# EAGLE design coin_acceptor (EAGLE 8.3.1)
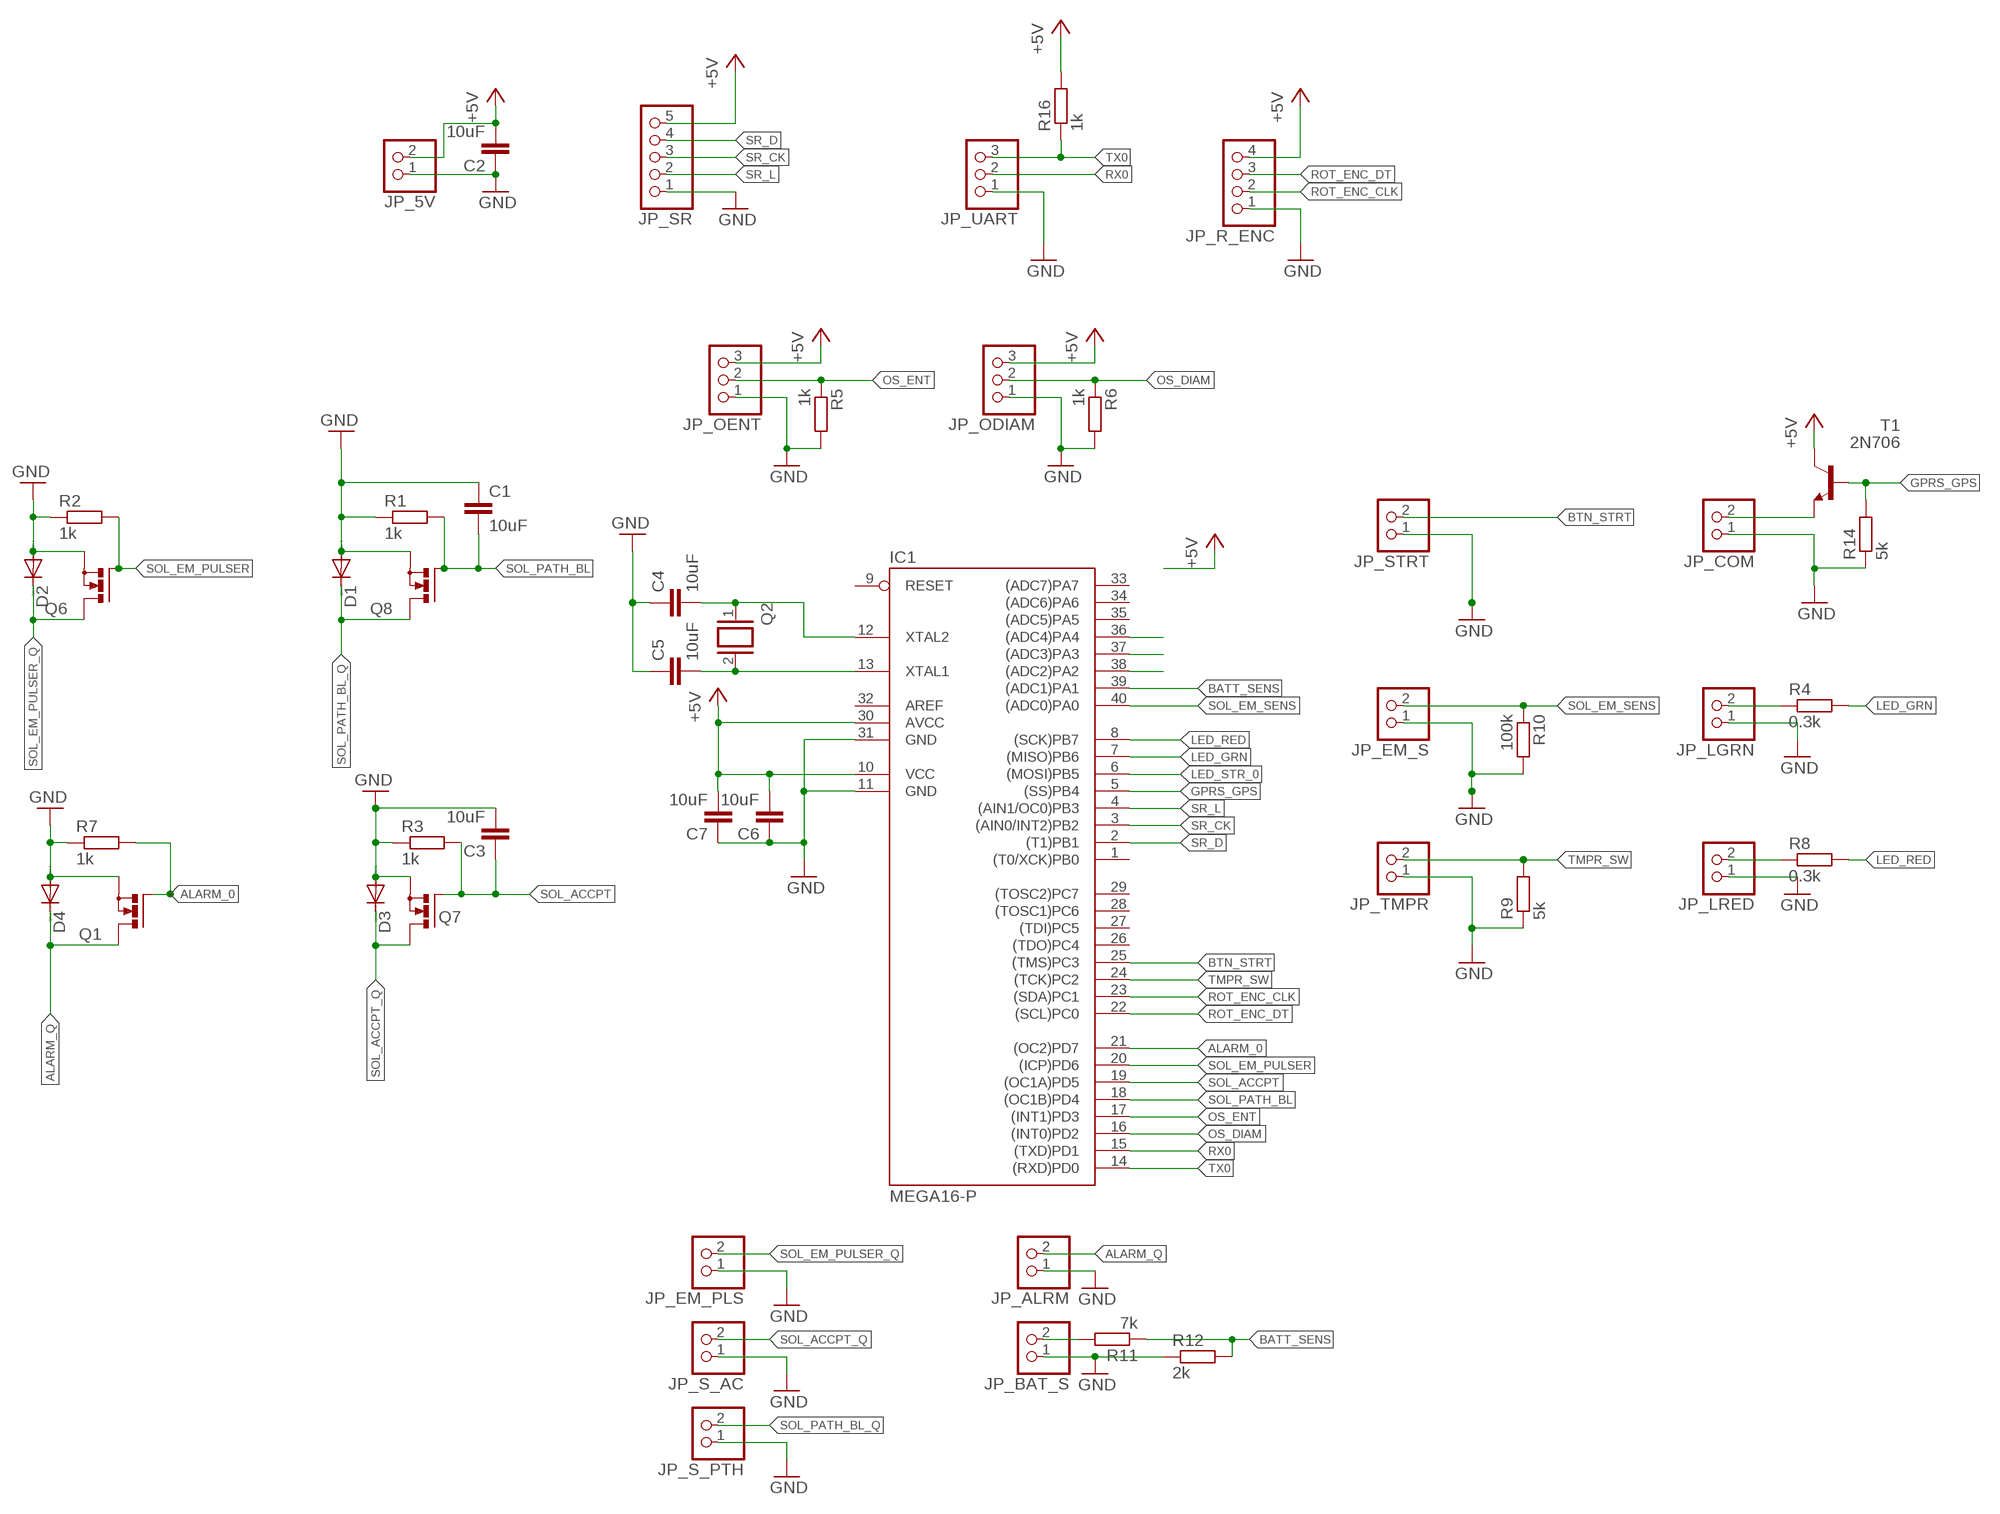
[diagram p0: schematic, sheet 1]

## Parts
C1  10uF  C-EU025-024X044  [C025-024X044]
C2  10uF  C-EU025-024X044  [C025-024X044]
C3  10uF  C-EU025-024X044  [C025-024X044]
C4  10uF  C-EU025-024X044  [C025-024X044]
C5  10uF  C-EU025-024X044  [C025-024X044]
C6  10uF  C-EU025-024X044  [C025-024X044]
C7  10uF  C-EU025-024X044  [C025-024X044]
D1  DIODE-DO35-10  [DO35-10]
D2  DIODE-DO35-10  [DO35-10]
D3  DIODE-DO35-10  [DO35-10]
D4  DIODE-DO35-10  [DO35-10]
IC1  MEGA16-P  [DIL40]
JP_5V  PINHD-1X2  [1X02]
JP_ALRM  PINHD-1X2  [1X02]
JP_BAT_S  PINHD-1X2  [1X02]
JP_COM  PINHD-1X2  [1X02]
JP_EM_PLS  PINHD-1X2  [1X02]
JP_EM_S  PINHD-1X2  [1X02]
JP_LGRN  PINHD-1X2  [1X02]
JP_LRED  PINHD-1X2  [1X02]
JP_ODIAM  PINHD-1X3  [1X03]
JP_OENT  PINHD-1X3  [1X03]
JP_R_ENC  PINHD-1X4  [1X04]
JP_S_AC  PINHD-1X2  [1X02]
JP_S_PTH  PINHD-1X2  [1X02]
JP_SR  PINHD-1X5  [1X05]
JP_STRT  PINHD-1X2  [1X02]
JP_TMPR  PINHD-1X2  [1X02]
JP_UART  PINHD-1X3  [1X03]
Q1  IRF512  [TO220BV]
Q2  XTAL  [Q]
Q6  IRF512  [TO220BV]
Q7  IRF512  [TO220BV]
Q8  IRF512  [TO220BV]
R1  1k  R-EU_0309/10  [0309/10]
R2  1k  R-EU_0309/10  [0309/10]
R3  1k  R-EU_0309/10  [0309/10]
R4  0.3k  R-EU_0309/10  [0309/10]
R5  1k  R-EU_0309/10  [0309/10]
R6  1k  R-EU_0309/10  [0309/10]
R7  1k  R-EU_0309/10  [0309/10]
R8  0.3k  R-EU_0309/10  [0309/10]
R9  5k  R-EU_0309/10  [0309/10]
R10  100k  R-EU_0309/10  [0309/10]
R11  7k  R-EU_0309/10  [0309/10]
R12  2k  R-EU_0309/10  [0309/10]
R14  5k  R-EU_0309/10  [0309/10]
R16  1k  R-EU_0309/10  [0309/10]
T1  2N706  [TO18]

## Nets
+5V [Supply]: C2.2 C6.2 C7.2 IC1.10(VCC) IC1.30(AVCC) JP_5V.2 JP_ODIAM.3 JP_OENT.3 JP_R_ENC.4 JP_SR.5 R16.2 T1.3(C)
ALARM_0: IC1.21((OC2)PD7) Q1.G R7.2
ALARM_Q: D4.C JP_ALRM.2 Q1.D
BATT_SENS: IC1.39((ADC1)PA1) R11.1 R12.2
BTN_STRT: IC1.25((TMS)PC3) JP_STRT.2
GND [Supply]: C1.1 C2.1 C3.2 C4.1 C5.1 C6.1 C7.1 D1.A D2.A D3.A D4.A IC1.11(GND) IC1.31(GND) JP_5V.1 JP_ALRM.1 JP_BAT_S.1 JP_COM.1 JP_EM_PLS.1 JP_EM_S.1 JP_LGRN.1 JP_LRED.1 JP_ODIAM.1 JP_OENT.1 JP_R_ENC.1 JP_S_AC.1 JP_S_PTH.1 JP_SR.1 JP_STRT.1 JP_TMPR.1 JP_UART.1 Q1.S Q6.S Q7.S Q8.S R1.1 R2.1 R3.1 R5.2 R6.2 R7.1 R9.1 R10.2 R12.1 R14.1
GPRS_GPS: IC1.5((SS)PB4) R14.2 T1.2(B)
LED_GRN: IC1.7((MISO)PB6) R4.2
LED_RED: IC1.8((SCK)PB7) R8.2
LED_STR_0: IC1.6((MOSI)PB5)
N$1: JP_BAT_S.2 R11.2
N$2: C4.2 IC1.12(XTAL2) Q2.1
N$4: IC1.38((ADC2)PA2)
N$5: IC1.37((ADC3)PA3)
N$6: IC1.36((ADC4)PA4)
N$7: C5.2 IC1.13(XTAL1) Q2.2
OS_DIAM: IC1.16((INT0)PD2) JP_ODIAM.2 R6.1
OS_ENT: IC1.17((INT1)PD3) JP_OENT.2 R5.1
ROT_ENC_CLK: IC1.23((SDA)PC1) JP_R_ENC.2
ROT_ENC_DT: IC1.22((SCL)PC0) JP_R_ENC.3
RX0: IC1.15((TXD)PD1) JP_UART.2
SOL_ACCPT: C3.1 IC1.19((OC1A)PD5) Q7.G R3.2
SOL_ACCPT_OUT2: JP_LGRN.2 R4.1
SOL_ACCPT_Q: D3.C JP_S_AC.2 Q7.D
SOL_EM_PULSER: IC1.20((ICP)PD6) Q6.G R2.2
SOL_EM_PULSER_OUT2: JP_COM.2 T1.1(E)
SOL_EM_PULSER_Q: D2.C JP_EM_PLS.2 Q6.D
SOL_EM_SENS [Analog]: IC1.40((ADC0)PA0) JP_EM_S.2 R10.1
SOL_PATH_BL: C1.2 IC1.18((OC1B)PD4) Q8.G R1.2
SOL_PATH_BL_OUT2: JP_LRED.2 R8.1
SOL_PATH_BL_Q: D1.C JP_S_PTH.2 Q8.D
SR_CK: IC1.3((AIN0/INT2)PB2) JP_SR.3
SR_D: IC1.2((T1)PB1) JP_SR.4
SR_L: IC1.4((AIN1/OC0)PB3) JP_SR.2
TMPR_SW: IC1.24((TCK)PC2) JP_TMPR.2 R9.2
TX0: IC1.14((RXD)PD0) JP_UART.3 R16.1
Unconnected: IC1.1((T0/XCK)PB0) IC1.9(RESET) IC1.26((TDO)PC4) IC1.27((TDI)PC5) IC1.28((TOSC1)PC6) IC1.29((TOSC2)PC7) IC1.32(AREF) IC1.33((ADC7)PA7) IC1.34((ADC6)PA6) IC1.35((ADC5)PA5)

## Library data of the parts
C1-C7 = rcl:C-EU: CAPACITOR, European symbol
D1-D4 = diode:DIODE-: DIODE
IC1 = atmel:MEGA16-P: MICROCONTROLLER 16 Kbytes FLASH 1 kbytes SRAM 512 bytes EEPROM USART 8-channel 10 bit ADC Source: avr.lbr; MPN: ATMEGA16-16PU; OC_FARNELL: 9171142; OC_NEWARK: 01M6885
JP_5V JP_ALRM JP_BAT_S JP_COM JP_EM_PLS JP_EM_S JP_LGRN JP_LRED JP_S_AC JP_S_PTH JP_STRT JP_TMPR = pinhead:PINHD-1X2: PIN HEADER
JP_ODIAM JP_OENT JP_UART = pinhead:PINHD-1X3: PIN HEADER
JP_R_ENC = pinhead:PINHD-1X4: PIN HEADER
JP_SR = pinhead:PINHD-1X5: PIN HEADER
Q1 Q6-Q8 = transistor-power:IRF512: N-CHANNEL MOS FET
Q2 = special:XTAL: CRYSTAL
R1-R12 R14 R16 = resistor:R-EU_: RESISTOR, European symbol
T1 = transistor:2N706: NPN TRANSISTOR

## Net classes
0 default: width 0.508 mm, drill 0.254 mm, clearance 0.305 mm
1 Supply: width 1.016 mm, drill 0.254 mm, clearance 0.305 mm
2 Analog: width 0.762 mm, drill 0.254 mm, clearance 0.61 mm

## Board
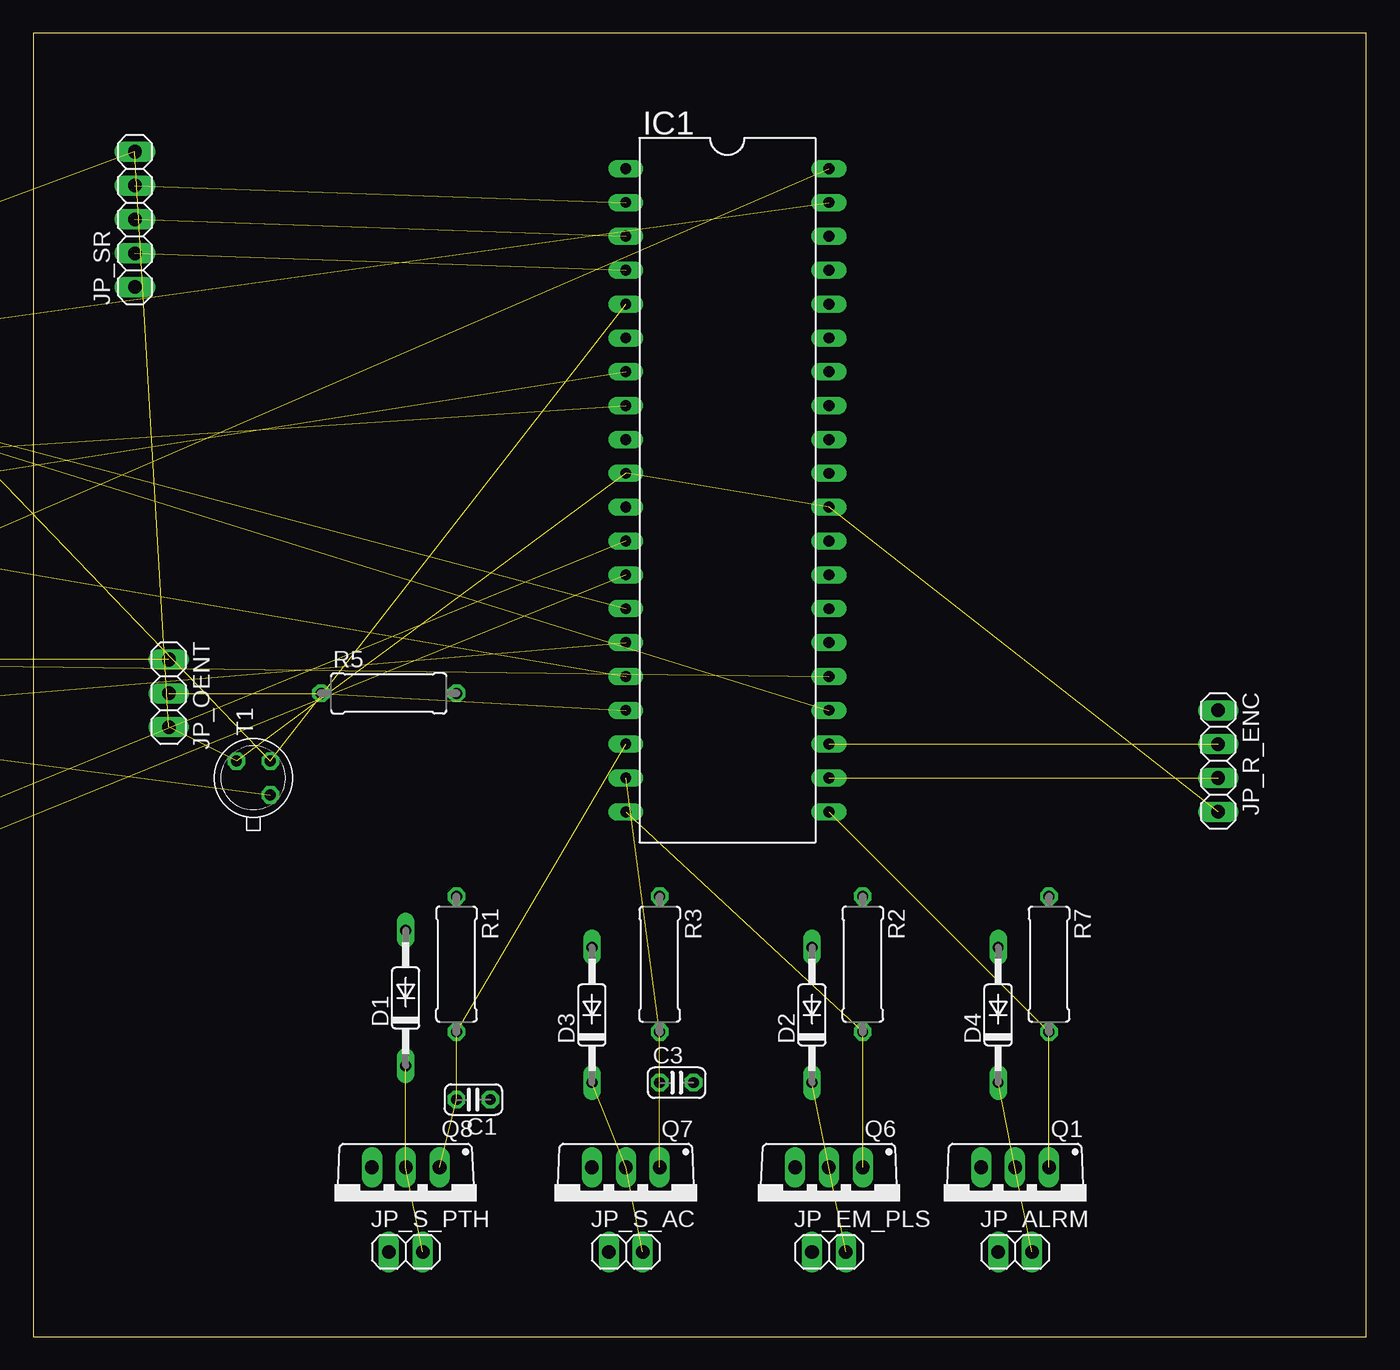
[diagram p1: board, top side]
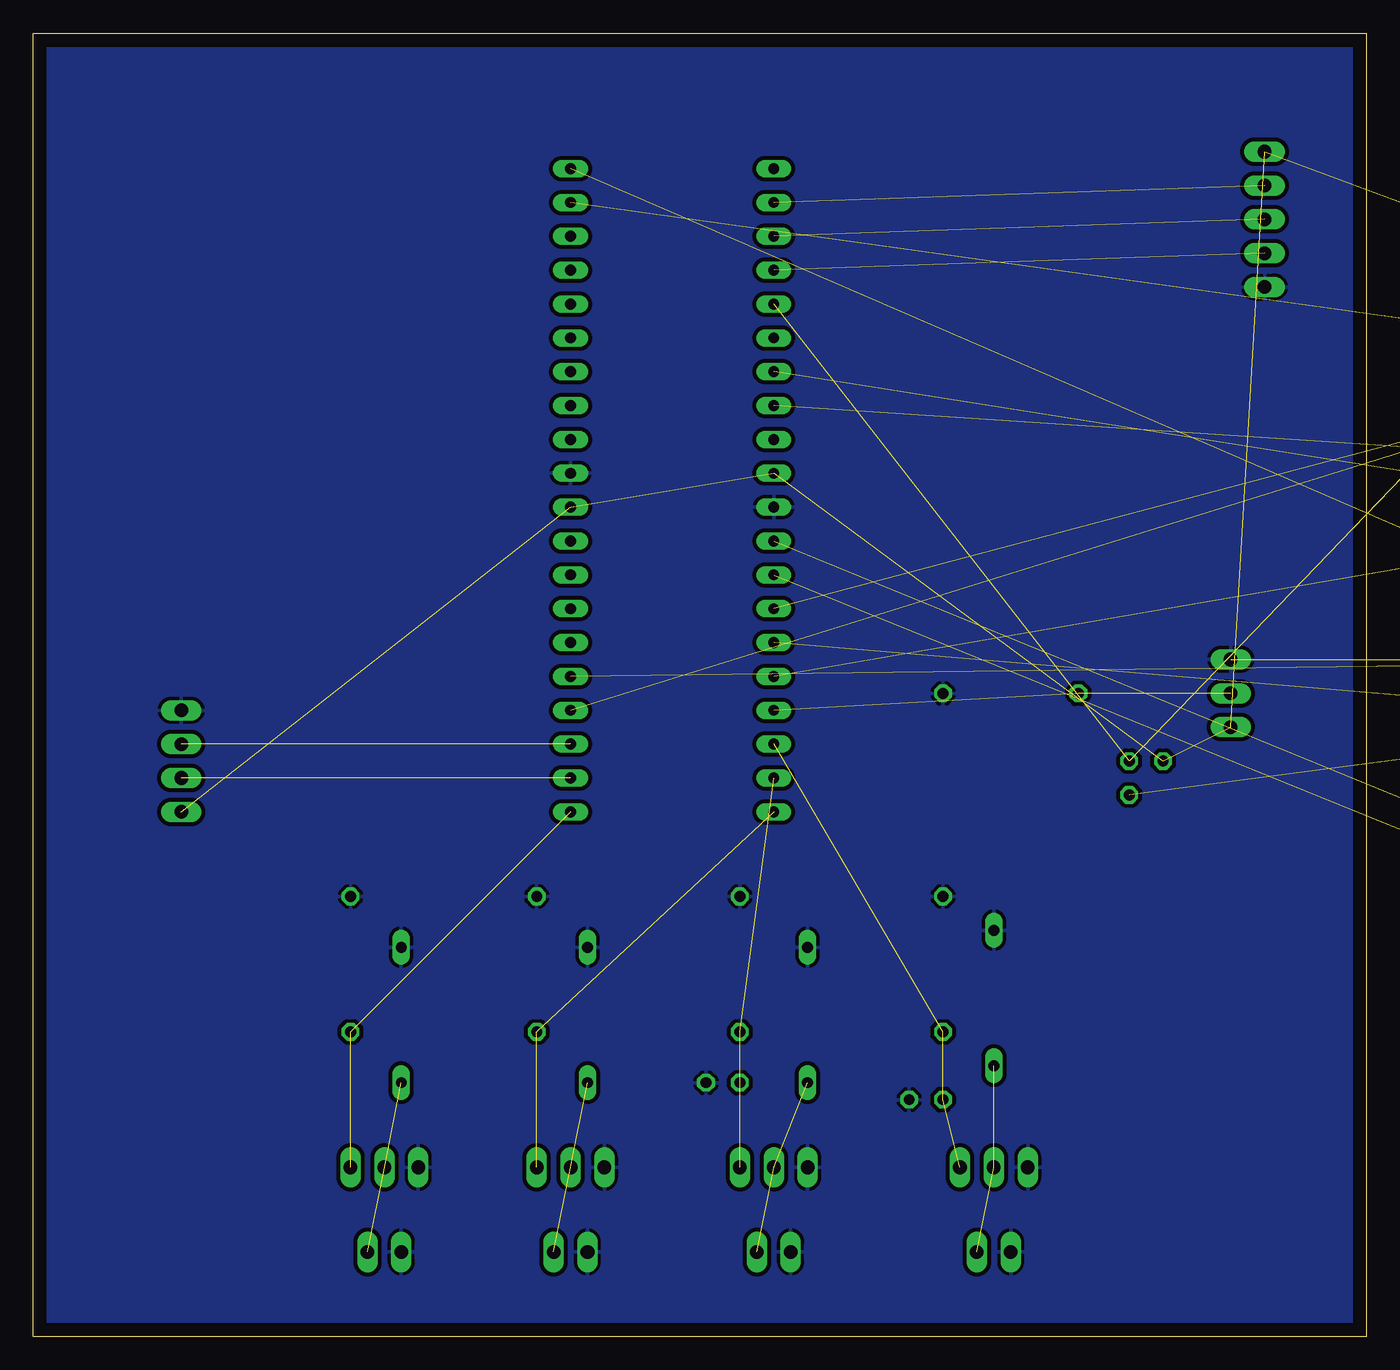
[diagram p2: board, bottom side, seen from below]

Size 100 x 97.78 mm. Coordinates in mm from the lower left corner, seen from the top.
Outline: 0,0 100,0 100,97.78 0,97.78 0,0
Copper layers (1*16): Top 0.035mm / dielectric 1.5mm / Bottom 0.035mm
Design rules "default": minimum track width 6mil, minimum drill 0.35mm, track to track 6mil, track to pad 6mil, pad to pad 6mil, via to via 6mil, smd to smd 6mil, copper to edge 40mil, drill to drill 6mil, minimum pad ring 10mil, minimum via ring 8mil, stop-mask expansion 4mil, vias tented up to drill 0mil, thermal gap 10mil

### Footprints (pad centres in the part's own frame; a part is rotated, then mirrored left to right if it is on the bottom)
C025-024X044 = drill 0.813 octagon: 1 -1.27,0; 2 1.27,0
DO35-10 = drill 0.813 long: A 5.08,0; C -5.08,0
DIL40 = drill 0.813 long: 1 -24.13,-7.62; 2 -21.59,-7.62; 3 -19.05,-7.62; 4 -16.51,-7.62; 5 -13.97,-7.62; 6 -11.43,-7.62; 7 -8.89,-7.62; 8 -6.35,-7.62; 9 -3.81,-7.62; 10 -1.27,-7.62; 11 1.27,-7.62; 12 3.81,-7.62; 13 6.35,-7.62; 14 8.89,-7.62; 15 11.43,-7.62; 16 13.97,-7.62; 17 16.51,-7.62; 18 19.05,-7.62; 19 21.59,-7.62; 20 24.13,-7.62; 21 24.13,7.62; 22 21.59,7.62; 23 19.05,7.62; 24 16.51,7.62; 25 13.97,7.62; 26 11.43,7.62; 27 8.89,7.62; 28 6.35,7.62; 29 3.81,7.62; 30 1.27,7.62; 31 -1.27,7.62; 32 -3.81,7.62; 33 -6.35,7.62; 34 -8.89,7.62; 35 -11.43,7.62; 36 -13.97,7.62; 37 -16.51,7.62; 38 -19.05,7.62; 39 -21.59,7.62; 40 -24.13,7.62
1X02 = drill 1.016 long: 1 -1.27,0; 2 1.27,0
1X03 = drill 1.016 long: 1 -2.54,0; 2 0,0; 3 2.54,0
1X04 = drill 1.016 long: 1 -3.81,0; 2 -1.27,0; 3 1.27,0; 4 3.81,0
1X05 = drill 1.016 long: 1 -5.08,0; 2 -2.54,0; 3 0,0; 4 2.54,0; 5 5.08,0
TO220BV = drill 1.016 long: D 0,-2.54; G -2.54,-2.54; S 2.54,-2.54
Q = drill 0.61 long: 1 -2.54,-7.62; 2 2.54,-7.62
0309/10 = drill 0.813 octagon: 1 -5.08,0; 2 5.08,0
TO18 = drill 0.813 octagon: 1 -1.27,-1.27; 2 1.27,-1.27; 3 1.27,1.27

### Placement (x,y rotation side)
C1  33.02,17.78 180 top
C2  -67.31,29.21 0 top  (outside the outline)
C3  48.26,19.05 0 top
C4  -86.36,-8.89 0 top  (outside the outline)
C5  -86.36,-22.86 0 top  (outside the outline)
C6  -86.36,-36.83 0 top  (outside the outline)
C7  -86.36,-50.8 0 top  (outside the outline)
D1  27.94,25.4 90 top
D2  58.42,24.13 90 top
D3  41.91,24.13 90 top
D4  72.39,24.13 90 top
IC1  52.07,63.5 270 top
JP_5V  -67.31,50.8 0 top  (outside the outline)
JP_ALRM  73.66,6.35 0 top
JP_BAT_S  -29.21,44.45 0 top  (outside the outline)
JP_COM  -60.96,50.8 0 top  (outside the outline)
JP_EM_PLS  59.69,6.35 0 top
JP_EM_S  -26.67,50.8 0 top  (outside the outline)
JP_LGRN  -17.78,50.8 0 top  (outside the outline)
JP_LRED  -35.56,50.8 0 top  (outside the outline)
JP_ODIAM  -67.31,38.1 0 top  (outside the outline)
JP_OENT  10.16,48.26 270 top
JP_R_ENC  88.9,43.18 270 top
JP_S_AC  44.45,6.35 0 top
JP_S_PTH  27.94,6.35 0 top
JP_SR  7.62,83.82 90 top
JP_STRT  -44.45,50.8 0 top  (outside the outline)
JP_TMPR  -55.88,44.45 0 top  (outside the outline)
JP_UART  -45.72,44.45 0 top  (outside the outline)
Q1  73.66,10.16 180 top
Q2  -86.36,12.7 0 top  (outside the outline)
Q6  59.69,10.16 180 top
Q7  44.45,10.16 180 top
Q8  27.94,10.16 180 top
R1  31.75,27.94 270 top
R2  62.23,27.94 270 top
R3  46.99,27.94 270 top
R4  -57.15,57.15 0 top  (outside the outline)
R5  26.67,48.26 0 top
R6  -31.75,63.5 0 top  (outside the outline)
R7  76.2,27.94 270 top
R8  -57.15,63.5 0 top  (outside the outline)
R9  -19.05,69.85 0 top  (outside the outline)
R10  -31.75,69.85 0 top  (outside the outline)
R11  -44.45,69.85 0 top  (outside the outline)
R12  -57.15,69.85 0 top  (outside the outline)
R14  -19.05,76.2 0 top  (outside the outline)
R16  -31.75,76.2 0 top  (outside the outline)
T1  16.51,41.91 90 top

### Tracks (layer width: path | path; a pad name or v marks a point on that pad's centre or on a via)
+5V  (11 unrouted)
ALARM_0  (2 unrouted)
ALARM_Q  (2 unrouted)
BATT_SENS  (2 unrouted)
BTN_STRT  (1 unrouted)
GND  (20 unrouted)
  pour Bottom: -5.08,97.79 -5.08,0 107.95,0 109.22,1.27 109.22,99.06 111.76,101.6 -1.27,101.6
GPRS_GPS  (2 unrouted)
LED_GRN  (1 unrouted)
LED_RED  (1 unrouted)
N$1  (1 unrouted)
N$2  (2 unrouted)
N$7  (2 unrouted)
OS_DIAM  (2 unrouted)
OS_ENT  (2 unrouted)
ROT_ENC_CLK  (1 unrouted)
ROT_ENC_DT  (1 unrouted)
RX0  (1 unrouted)
SOL_ACCPT  (3 unrouted)
SOL_ACCPT_OUT2  (1 unrouted)
SOL_ACCPT_Q  (2 unrouted)
SOL_EM_PULSER  (2 unrouted)
SOL_EM_PULSER_OUT2  (1 unrouted)
SOL_EM_PULSER_Q  (2 unrouted)
SOL_EM_SENS  (2 unrouted)
SOL_PATH_BL  (3 unrouted)
SOL_PATH_BL_OUT2  (1 unrouted)
SOL_PATH_BL_Q  (2 unrouted)
SR_CK  (1 unrouted)
SR_D  (1 unrouted)
SR_L  (1 unrouted)
TMPR_SW  (2 unrouted)
TX0  (2 unrouted)